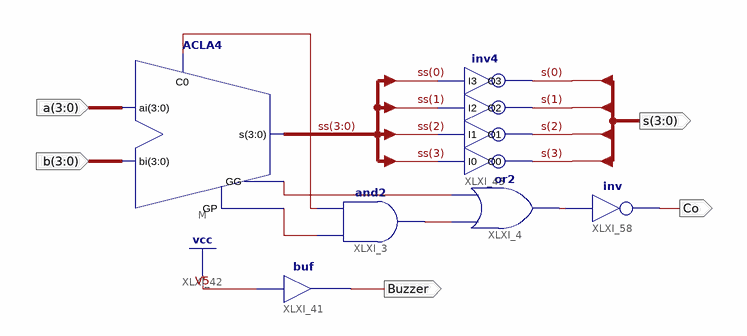
[diagram p0: schematic sheet 1]
// Xilinx ISE schematic Top_ACLA.sch (kintex7) as structural Verilog: 6 symbols, 5 ports
module Top_ACLA (
  input  [3:0] a,
  input  [3:0] b,
  output [3:0] s,
  output Co,
  output Buzzer
);

  wire XLXN_1, XLXN_2, XLXN_3, XLXN_4, XLXN_106;
  wire [3:0] ss;

  ACLA4 M (.s(ss), .ai(a), .bi(b), .C0(XLXN_4), .GG(XLXN_2), .GP(XLXN_3));
  and XLXI_3 (XLXN_1, XLXN_3, XLXN_4);
  or XLXI_4 (XLXN_106, XLXN_1, XLXN_2);
  inv4 XLXI_43 (.I0(ss[3]), .I1(ss[2]), .I2(ss[1]), .I3(ss[0]), .O0(s[3]), .O1(s[2]), .O2(s[1]), .O3(s[0]));
  not XLXI_58 (Co, XLXN_106);
  buf XLXI_41 (Buzzer, 1'b1);
endmodule
